# Altium project RK_MEGAPLATA.PrjPcb (part 8 of 9)

## Sheet ETHERNET_PHY_RGMII.SchDoc
size 594 x 420 mm; SheetNumber: 22; SheetTotal: 23
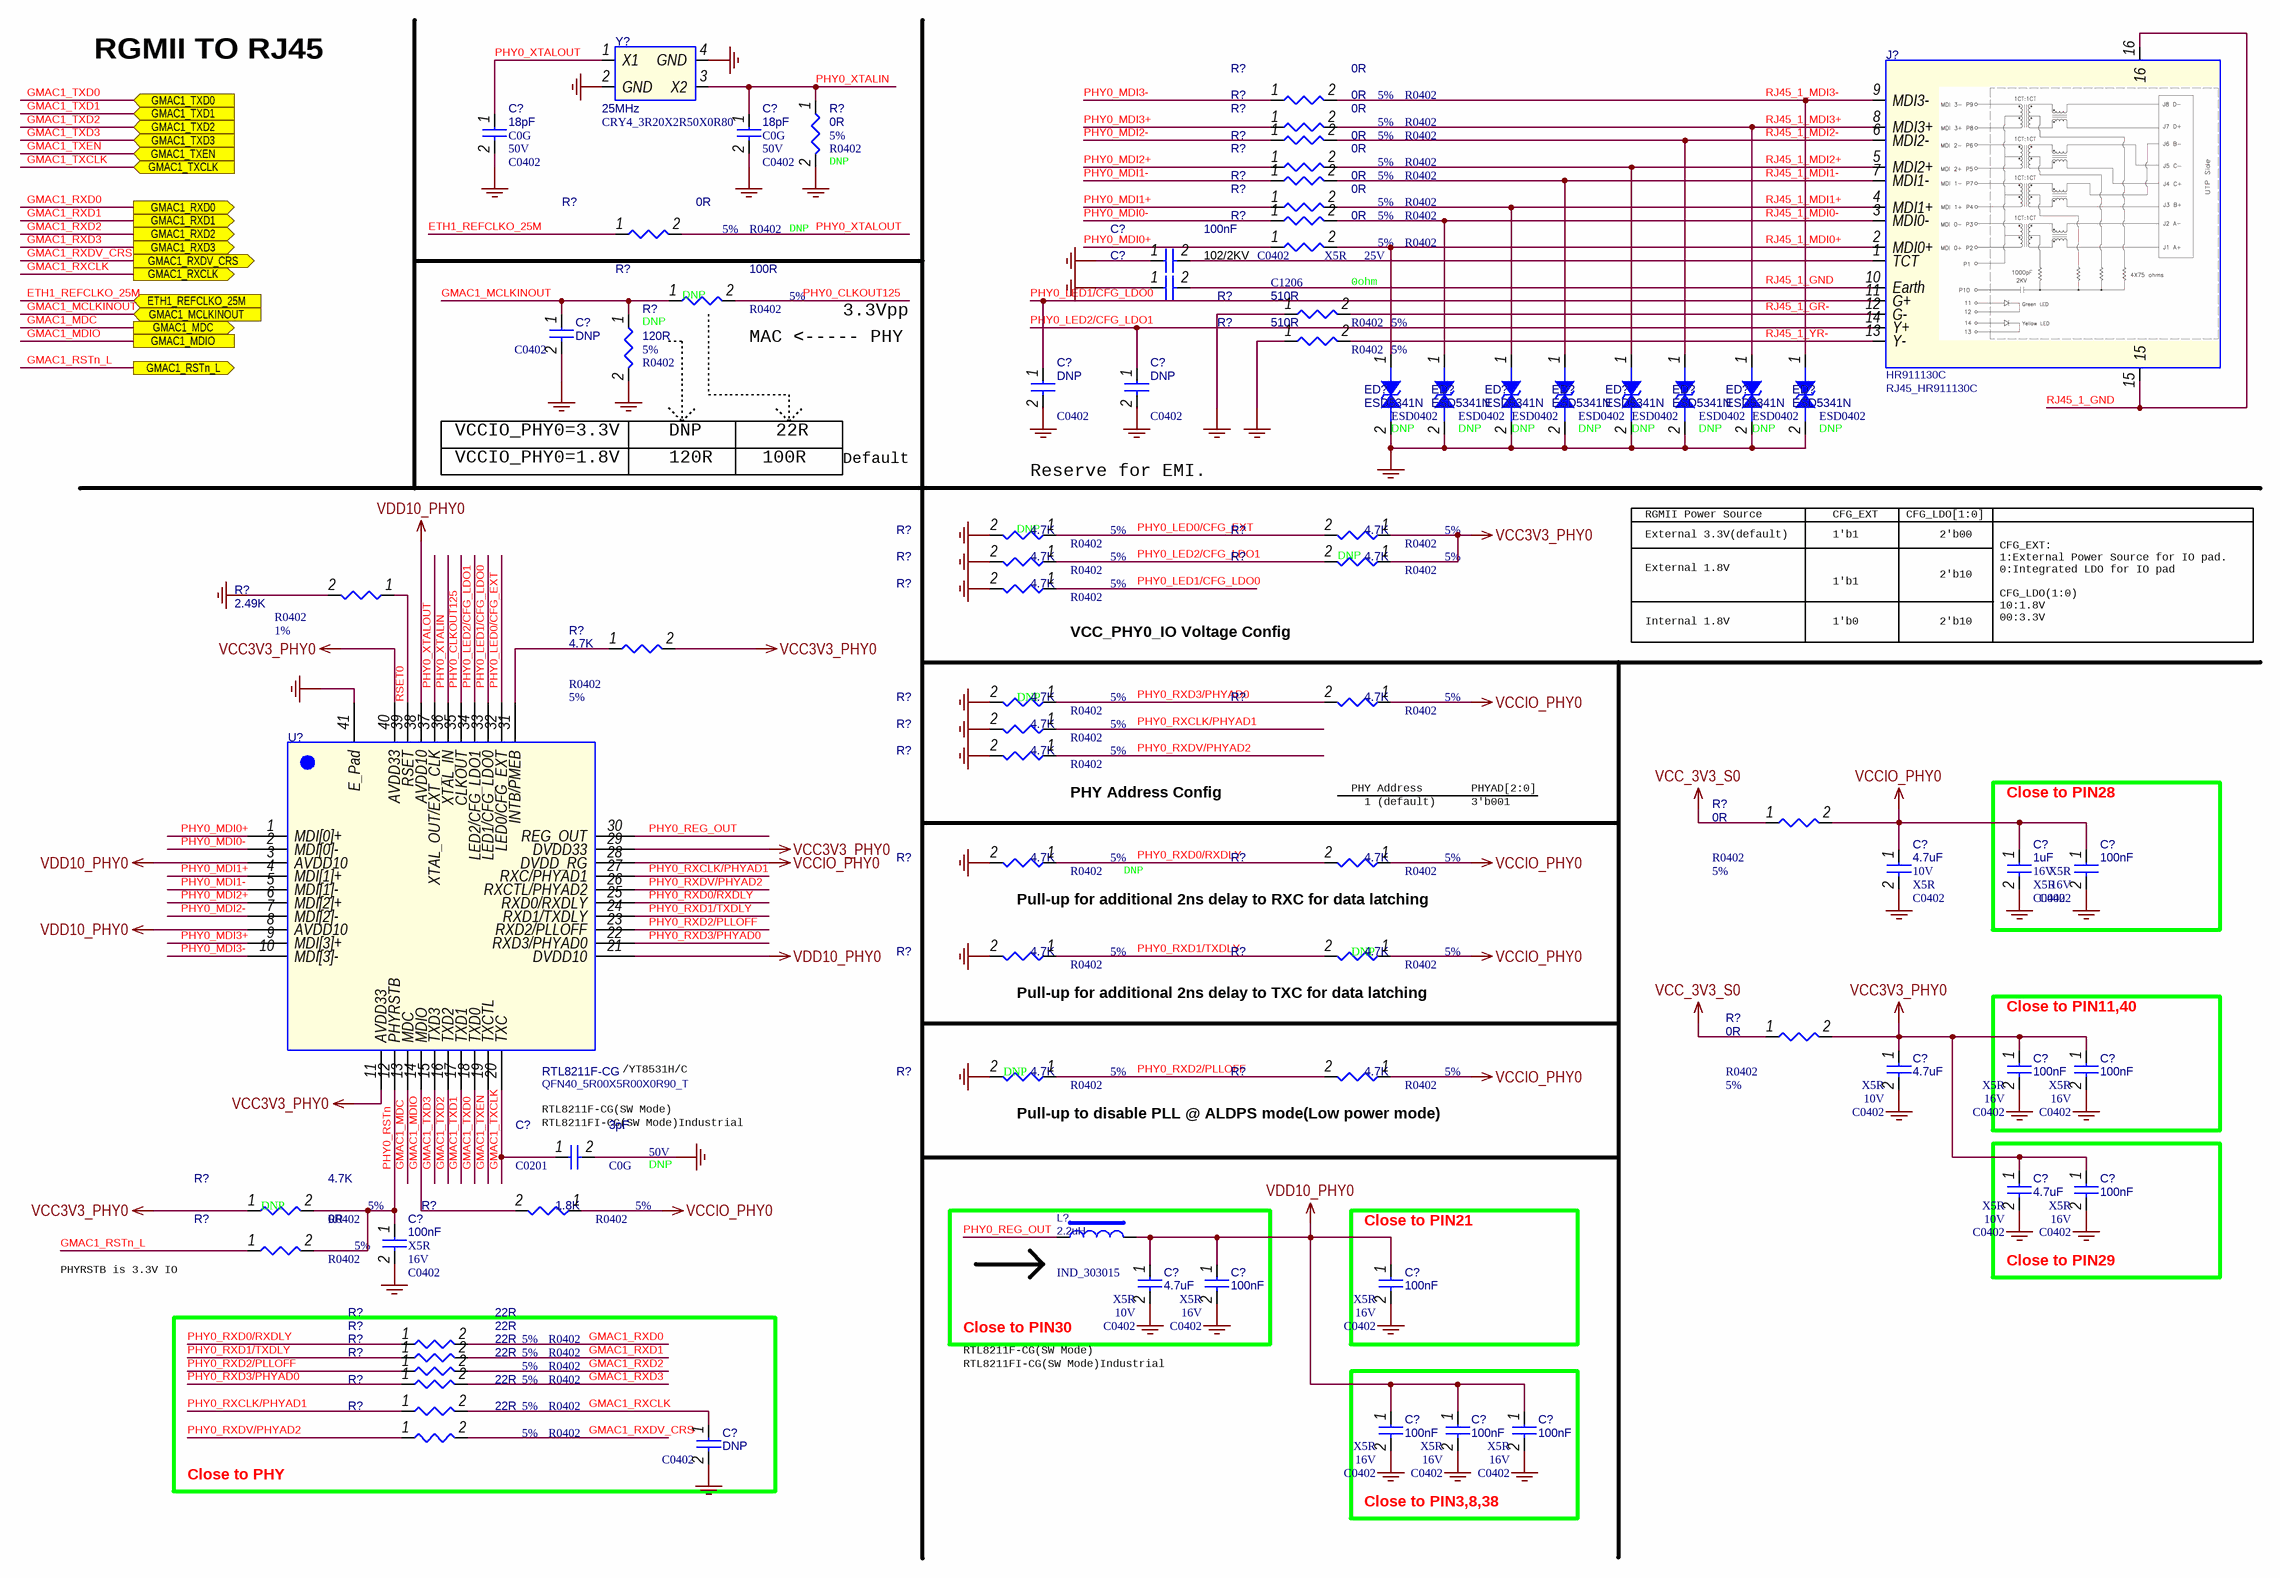
[diagram p24: ETHERNET_PHY_RGMII.SchDoc]

### Parts
(Parts that share a designator on the sheet are numbered #1, #2 ... from top to bottom, then left to right.)
C?#312  18pF  Dielectric: C0G  Voltage: 50V  [C0402]
C?#313  18pF  Dielectric: C0G  Voltage: 50V  [C0402]
C?#314  100nF  Dielectric: X5R  Voltage: 25V  [C0402]
C?#315  102/2KV  Option: 0ohm  [C1206]
C?#316  DNP  [C0402]
C?#317  DNP  [C0402]
C?#318  DNP  [C0402]
C?#319  4.7uF  Dielectric: X5R  Voltage: 10V  [C0402]
C?#320  1uF  Dielectric: X5R  Voltage: 16V  [C0402]
C?#321  100nF  Dielectric: X5R  Voltage: 16V  [C0402]
C?#322  4.7uF  Dielectric: X5R  Voltage: 10V  [C0402]
C?#323  100nF  Dielectric: X5R  Voltage: 16V  [C0402]
C?#324  100nF  Dielectric: X5R  Voltage: 16V  [C0402]
C?#325  3pF  Dielectric: C0G  Voltage: 50V  OPTION: DNP  [C0201]
C?#326  4.7uF  Dielectric: X5R  Voltage: 10V  [C0402]
C?#327  100nF  Dielectric: X5R  Voltage: 16V  [C0402]
C?#328  100nF  Dielectric: X5R  Voltage: 16V  [C0402]
C?#329  4.7uF  Dielectric: X5R  Voltage: 10V  [C0402]
C?#330  100nF  Dielectric: X5R  Voltage: 16V  [C0402]
C?#331  100nF  Dielectric: X5R  Voltage: 16V  [C0402]
C?#332  100nF  Dielectric: X5R  Voltage: 16V  [C0402]
C?#333  100nF  Dielectric: X5R  Voltage: 16V  [C0402]
C?#334  100nF  Dielectric: X5R  Voltage: 16V  [C0402]
C?#335  DNP  [C0402]
ED?#13  ESD5341N  OPTION: DNP  [ESD0402]
ED?#14  ESD5341N  OPTION: DNP  [ESD0402]
ED?#15  ESD5341N  OPTION: DNP  [ESD0402]
ED?#16  ESD5341N  OPTION: DNP  [ESD0402]
ED?#17  ESD5341N  OPTION: DNP  [ESD0402]
ED?#18  ESD5341N  OPTION: DNP  [ESD0402]
ED?#19  ESD5341N  OPTION: DNP  [ESD0402]
ED?#20  ESD5341N  OPTION: DNP  [ESD0402]
J?#8  HR911130C  PCB Footprint: RJ45_HR911130C  [RJ45_PULSE]
L?#16  2.2uH  [IND_303015]
R?#166  0R  Tolerance: 5%  OPTION: DNP  [R0402]
R?#167  0R  Tolerance: 5%  [R0402]
R?#168  0R  Tolerance: 5%  [R0402]
R?#169  0R  Tolerance: 5%  [R0402]
R?#170  0R  Tolerance: 5%  [R0402]
R?#171  0R  Tolerance: 5%  [R0402]
R?#172  0R  Tolerance: 5%  [R0402]
R?#173  0R  Tolerance: 5%  [R0402]
R?#174  0R  Tolerance: 5%  OPTION: DNP  [R0402]
R?#175  0R  Tolerance: 5%  [R0402]
R?#176  100R  Tolerance: 5%  OPTION: DNP  [R0402]
R?#177  120R  Tolerance: 5%  OPTION: DNP  [R0402]
R?#178  510R  Tolerance: 5%  [R0402]
R?#179  510R  Tolerance: 5%  [R0402]
R?#180  4.7K  Tolerance: 5%  option: DNP  [R0402]
R?#181  4.7K  Tolerance: 5%  [R0402]
R?#182  4.7K  Tolerance: 5%  [R0402]
R?#183  4.7K  Tolerance: 5%  OPTION: DNP  [R0402]
R?#184  4.7K  Tolerance: 5%  [R0402]
R?#185  2.49K  Tolerance: 1%  [R0402]
R?#186  4.7K  Tolerance: 5%  [R0402]
R?#187  4.7K  Tolerance: 5%  option: DNP  [R0402]
R?#188  4.7K  Tolerance: 5%  [R0402]
R?#189  4.7K  Tolerance: 5%  [R0402]
R?#190  4.7K  Tolerance: 5%  [R0402]
R?#191  0R  Tolerance: 5%  [R0402]
R?#192  4.7K  Tolerance: 5%  OPTION: DNP  [R0402]
R?#193  4.7K  Tolerance: 5%  [R0402]
R?#194  4.7K  Tolerance: 5%  [R0402]
R?#195  4.7K  Tolerance: 5%  option: DNP  [R0402]
R?#196  0R  Tolerance: 5%  [R0402]
R?#197  4.7K  Tolerance: 5%  option: DNP  [R0402]
R?#198  4.7K  Tolerance: 5%  [R0402]
R?#199  1.8K  Tolerance: 5%  [R0402]
R?#200  4.7K  Tolerance: 5%  Option: DNP  [R0402]
R?#201  0R  Tolerance: 5%  [R0402]
R?#202  22R  Tolerance: 5%  [R0402]
R?#203  22R  Tolerance: 5%  [R0402]
R?#204  22R  Tolerance: 5%  [R0402]
R?#205  22R  Tolerance: 5%  [R0402]
R?#206  22R  Tolerance: 5%  [R0402]
R?#207  22R  Tolerance: 5%  [R0402]
U?#41  RTL8211F-CG  PCB Footprint: QFN40_5R00X5R00X0R90_T  [QFN40_5R00X5R00X0R80_T]
Y?#2  25MHz  PCB Footprint: CRY4_3R20X2R50X0R80  [CRY-3225]

### Blocks framed on the sheet
Close to PIN28: C?#320 C?#321
Close to PIN11,40: C?#323 C?#324
Close to PIN29: C?#326 C?#327
Close to PIN30: C?#329 C?#330 L?#16
Close to PIN21: C?#331
Close to PHY: C?#335 R?#202-R?#207
Close to PIN3,8,38: C?#332-C?#334

### Ports
ETH1_REFCLKO_25M (in, see RK3588_GPIO_MAYBE_IMPORTANT_PINS[2A]), GMAC1_MCLKINOUT (in, see RK3588_GPIO_MAYBE_IMPORTANT_PINS[2B]), GMAC1_MDC (out, see RK3588_GPIO_MAYBE_IMPORTANT_PINS[2B]), GMAC1_MDIO (see RK3588_GPIO_MAYBE_IMPORTANT_PINS[2B]), GMAC1_RSTn_L (out, see RK3588_GPIO_MAYBE_IMPORTANT_PINS[2B]), GMAC1_RXCLK (out, see RK3588_GPIO_MAYBE_IMPORTANT_PINS[2A]), GMAC1_RXD0 (out, see RK3588_GPIO_MAYBE_IMPORTANT_PINS[2A]), GMAC1_RXD1 (out, see RK3588_GPIO_MAYBE_IMPORTANT_PINS[2A]), GMAC1_RXD2 (out, see RK3588_GPIO_MAYBE_IMPORTANT_PINS[2A]), GMAC1_RXD3 (out, see RK3588_GPIO_MAYBE_IMPORTANT_PINS[2A]), GMAC1_RXDV_CRS (out, see RK3588_GPIO_MAYBE_IMPORTANT_PINS[2A]), GMAC1_TXCLK (in, see RK3588_GPIO_MAYBE_IMPORTANT_PINS[2A]), GMAC1_TXD0 (in, see RK3588_GPIO_MAYBE_IMPORTANT_PINS[2A]), GMAC1_TXD1 (in, see RK3588_GPIO_MAYBE_IMPORTANT_PINS[2B]), GMAC1_TXD2 (in, see RK3588_GPIO_MAYBE_IMPORTANT_PINS[2A]), GMAC1_TXD3 (in, see RK3588_GPIO_MAYBE_IMPORTANT_PINS[2A]), GMAC1_TXEN (in, see RK3588_GPIO_MAYBE_IMPORTANT_PINS[2B])

### Nets
GND: C?#312.2 C?#313.2 C?#314.1 C?#315.1 C?#316.2 C?#317.2 C?#318.2 C?#319.2 C?#320.2 C?#321.2 C?#322.2 C?#323.2 C?#324.2 C?#325.2 C?#326.2 C?#327.2 C?#328.2 C?#329.2 C?#330.2 C?#331.2 C?#332.2 C?#333.2 C?#334.2 C?#335.2 ED?#13.2 ED?#14.2 ED?#15.2 ED?#16.2 ED?#17.2 ED?#18.2 ED?#19.2 ED?#20.2 R?#166.2 R?#177.2 R?#178.1 R?#179.1 R?#180.2 R?#182.2 R?#184.2 R?#185.2 R?#187.2 R?#189.2 R?#190.2 R?#192.2 R?#194.2 R?#197.2 U?#41.41(E_Pad) Y?#2.2(GND) Y?#2.4(GND)
VCC3V3_PHY0: C?#322.1 C?#323.1 C?#324.1 C?#326.1 C?#327.1 R?#181.1 R?#183.1 R?#186.2 R?#196.2 R?#200.1 U?#41.11(AVDD33) U?#41.29(DVDD33) U?#41.40(AVDD33)
VCC_3V3_S0: R?#191.1 R?#196.1
VCCIO_PHY0: C?#319.1 C?#320.1 C?#321.1 R?#188.1 R?#191.2 R?#193.1 R?#195.1 R?#198.1 R?#199.1 U?#41.28(DVDD_RG)
VDD10_PHY0: C?#329.1 C?#330.1 C?#331.1 C?#332.1 C?#333.1 C?#334.1 L?#16.2 U?#41.3(AVDD10) U?#41.8(AVDD10) U?#41.21(DVDD10) U?#41.38(AVDD10)
ETH1_REFCLKO_25M: R?#174.1 ; port ETH1_REFCLKO_25M
GMAC1_MCLKINOUT: C?#316.1 R?#176.1 R?#177.1 ; port GMAC1_MCLKINOUT
GMAC1_MDC: U?#41.13(MDC) ; port GMAC1_MDC
GMAC1_MDIO: R?#199.2 U?#41.14(MDIO) ; port GMAC1_MDIO
GMAC1_RSTn_L: R?#201.1 ; port GMAC1_RSTn_L
GMAC1_RXCLK: C?#335.1 R?#206.2 ; port GMAC1_RXCLK
GMAC1_RXD0: R?#202.2 ; port GMAC1_RXD0
GMAC1_RXD1: R?#203.2 ; port GMAC1_RXD1
GMAC1_RXD2: R?#204.2 ; port GMAC1_RXD2
GMAC1_RXD3: R?#205.2 ; port GMAC1_RXD3
GMAC1_RXDV_CRS: R?#207.2 ; port GMAC1_RXDV_CRS
GMAC1_TXCLK: C?#325.1 U?#41.20(TXC) ; port GMAC1_TXCLK
GMAC1_TXD0: U?#41.18(TXD0) ; port GMAC1_TXD0
GMAC1_TXD1: U?#41.17(TXD1) ; port GMAC1_TXD1
GMAC1_TXD2: U?#41.16(TXD2) ; port GMAC1_TXD2
GMAC1_TXD3: U?#41.15(TXD3) ; port GMAC1_TXD3
GMAC1_TXEN: U?#41.19(TXCTL) ; port GMAC1_TXEN
PHY0_CLKOUT125: R?#176.2 U?#41.35(CLKOUT)
PHY0_LED0/CFG_EXT: R?#180.1 R?#181.2 U?#41.32(LED0/CFG_EXT)
PHY0_LED1/CFG_LDO0: C?#317.1 J?#8.11(G+) R?#184.1 U?#41.33(LED1/CFG_LDO0)
PHY0_LED2/CFG_LDO1: C?#318.1 J?#8.14(Y+) R?#182.1 R?#183.2 U?#41.34(LED2/CFG_LDO1)
PHY0_MDI0+: R?#175.1 U?#41.1(MDI[0]+)
PHY0_MDI0-: R?#173.1 U?#41.2(MDI[0]-)
PHY0_MDI1+: R?#172.1 U?#41.4(MDI[1]+)
PHY0_MDI1-: R?#171.1 U?#41.5(MDI[1]-)
PHY0_MDI2+: R?#170.1 U?#41.6(MDI[2]+)
PHY0_MDI2-: R?#169.1 U?#41.7(MDI[2]-)
PHY0_MDI3+: R?#168.1 U?#41.9(MDI[3]+)
PHY0_MDI3-: R?#167.1 U?#41.10(MDI[3]-)
PHY0_REG_OUT: L?#16.1 U?#41.30(REG_OUT)
PHY0_RSTn: C?#328.1 R?#200.2 R?#201.2 U?#41.12(PHYRSTB)
PHY0_RXCLK/PHYAD1: R?#189.1 R?#206.1 U?#41.27(RXC/PHYAD1)
PHY0_RXD0/RXDLY: R?#192.1 R?#193.2 R?#202.1 U?#41.25(RXD0/RXDLY)
PHY0_RXD1/TXDLY: R?#194.1 R?#195.2 R?#203.1 U?#41.24(RXD1/TXDLY)
PHY0_RXD2/PLLOFF: R?#197.1 R?#198.2 R?#204.1 U?#41.23(RXD2/PLLOFF)
PHY0_RXD3/PHYAD0: R?#187.1 R?#188.2 R?#205.1 U?#41.22(RXD3/PHYAD0)
PHY0_RXDV/PHYAD2: R?#190.1 R?#207.1 U?#41.26(RXCTL/PHYAD2)
PHY0_XTALIN: C?#313.1 R?#166.1 U?#41.36(XTAL_IN) Y?#2.3(X2)
PHY0_XTALOUT: C?#312.1 R?#174.2 U?#41.37(XTAL_OUT/EXT_CLK) Y?#2.1(X1)
RJ45_1_GND: C?#315.2 J?#8.10(Earth) J?#8.15 J?#8.16
RJ45_1_GR-: J?#8.12(G-) R?#178.2
RJ45_1_MDI0+: ED?#13.1 J?#8.2(MDI0+) R?#175.2
RJ45_1_MDI0-: ED?#14.1 J?#8.3(MDI0-) R?#173.2
RJ45_1_MDI1+: ED?#15.1 J?#8.4(MDI1+) R?#172.2
RJ45_1_MDI1-: ED?#16.1 J?#8.7(MDI1-) R?#171.2
RJ45_1_MDI2+: ED?#17.1 J?#8.5(MDI2+) R?#170.2
RJ45_1_MDI2-: ED?#18.1 J?#8.6(MDI2-) R?#169.2
RJ45_1_MDI3+: ED?#19.1 J?#8.8(MDI3+) R?#168.2
RJ45_1_MDI3-: ED?#20.1 J?#8.9(MDI3-) R?#167.2
RJ45_1_YR-: J?#8.13(Y-) R?#179.2
RSET0: R?#185.1 U?#41.39(RSET)
NetC?#314_2: C?#314.2 J?#8.1(TCT)
NetR?#186_1: R?#186.1 U?#41.31(INTB/PMEB)

### Notes on the sheet
- RGMII TO RJ45
- (near R?#176) MAC <----- PHY
- 3.3Vpp
- VCCIO_PHY0=3.3V
- DNP
- 22R
- VCCIO_PHY0=1.8V
- 120R
- 100R
- Default
- Reserve for EMI.
- RGMII Power Source
- External 3.3V(default)
- External 1.8V
- CFG_EXT
- 1'b1
- CFG_LDO[1:0]
- 2'b00
- Internal 1.8V
- 1'b0
- 2'b10
- CFG_EXT:
  1:External Power Source for IO pad.
  0:Integrated LDO for IO pad
  CFG_LDO(1:0)
  10:1.8V
  00:3.3V
- (near R?#184) VCC_PHY0_IO Voltage Config
- (near R?#190) PHY Address Config
- PHY Address
- 1 (default)
- PHYAD[2:0]
- 3'b001
- (near R?#193) Pull-up for additional 2ns delay to RXC for data latching
- (near R?#194) Pull-up for additional 2ns delay to TXC for data latching
- (near U?#41) /YT8531H/C
- RTL8211F-CG(SW Mode)
- (near C?#325) RTL8211FI-CG(SW Mode)Industrial
- (near R?#198) Pull-up to disable PLL @ ALDPS mode(Low power mode)
- PHYRSTB is 3.3V IO
- RTL8211FI-CG(SW Mode)Industrial
- 420x594
- Формат А2

### Library data of the parts
C?#312 = CAP NP_Dup1: cap,18.00pF,+/-5%,50V,C0G,C0402; Part Reference: C6701; Manufacturer: TDK; RK PN: C1005C0G1H180J050BA; Priority: A; Tolerance: 5%; PCB Footprint: C0402; Value: 18pF; Part Type: C0402; Manufacturer PN: C1005C0G1H180J050BA; Created by: JJJ
C?#313 = CAP NP_Dup1: cap,18.00pF,+/-5%,50V,C0G,C0402; Part Reference: C6700; Manufacturer: TDK; RK PN: C1005C0G1H180J050BA; Priority: A; Tolerance: 5%; PCB Footprint: C0402; Value: 18pF; Part Type: C0402; Manufacturer PN: C1005C0G1H180J050BA; Created by: JJJ
C?#314 = CAP NP_Dup1: cap,100.00nF,+/-10%,25V,X5R,C0402; Part Reference: C6702; Manufacturer PN: C1005X5R1E104K050BC; Manufacturer: TDK; Tolerance: 10%; Priority: A; PCB Footprint: C0402; Value: 100nF; Created by: JJJ; Part Type: C0402; RK PN: C1005X5R1E104K050BC
C?#315 = CAP NP_Dup1: cap,10.00uF,+/-10%,50V,X5R,C1206; Part Reference: C6703; Manufacturer PN: C3216X5R1H106K160AB; Manufacturer: TDK; C_Voltage: 6.3V; Tolerance: 10%; Priority: A; Number: 37; Dielectric: X5R; PCB Footprint: C1206; Voltage: 50V; Value: 102/2KV; Created by: JJJ; Part Type: C1206; RK PN: C3216X5R1H106K160AB
C?#316 = CAP NP_Dup1: Did Not Place.; Part Reference: C6704; Manufacturer PN: DNPC0402; C_Voltage: 6.3V; Priority: A; Number: 37; PCB Footprint: C0402; Value: DNP; Created by: JJJ; Part Type: DNP; RK PN: DNPC0402
C?#317 = CAP NP_Dup1: Did Not Place.; Part Reference: C6750; Manufacturer PN: DNPC0402; Priority: A; PCB Footprint: C0402; Value: DNP; Created by: JJJ; Part Type: DNP; RK PN: DNPC0402
C?#318 = CAP NP_Dup1: Did Not Place.; Part Reference: C6751; Manufacturer PN: DNPC0402; Priority: A; PCB Footprint: C0402; Value: DNP; Created by: JJJ; Part Type: DNP; RK PN: DNPC0402
C?#319 = CAP NP_Dup1: cap,4.70uF,+/-10%,10V,X5R,C0402; Part Reference: C6707; Manufacturer: TDK; RK PN: C1005X5R1A475K050BC; Priority: A; C_Voltage: 6.3V; Tolerance: 10%; PCB Footprint: C0402; Value: 4.7uF; Part Type: C0402; Manufacturer PN: C1005X5R1A475K050BC; Created by: JJJ
C?#320 = CAP NP_Dup1: cap,1.00uF,+/-10%,16V,X5R,C0402; Part Reference: C6708; Manufacturer: TDK; RK PN: C1005X5R1C105K050BC; Priority: A; C_Voltage: 6.3V; Tolerance: 10%; PCB Footprint: C0402; Value: 1uF; Part Type: C0402; Manufacturer PN: C1005X5R1C105K050BC; Created by: JJJ
C?#321 = CAP NP_Dup1: cap,100.00nF,+/-10%,16V,X5R,C0402; Part Reference: C6709; Manufacturer: TDK; Number: 37; RK PN: C1005X5R1C104K050BA; Priority: A; Tolerance: 10%; C_Voltage: 6.3V; PCB Footprint: C0402; Value: 100nF; Part Type: C0402; Manufacturer PN: C1005X5R1C104K050BA; Created by: JJJ
C?#322 = CAP NP_Dup1: cap,4.70uF,+/-10%,10V,X5R,C0402; Part Reference: C6710; Manufacturer: TDK; RK PN: C1005X5R1A475K050BC; Priority: A; C_Voltage: 6.3V; Tolerance: 10%; PCB Footprint: C0402; Value: 4.7uF; Part Type: C0402; Manufacturer PN: C1005X5R1A475K050BC; Created by: JJJ
C?#323 = CAP NP_Dup1: cap,100.00nF,+/-10%,16V,X5R,C0402; Part Reference: C6711; Manufacturer PN: C1005X5R1C104K050BA; Manufacturer: TDK; C_Voltage: 6.3V; Tolerance: 10%; Priority: A; Number: 37; PCB Footprint: C0402; Value: 100nF; Created by: JJJ; Part Type: C0402; RK PN: C1005X5R1C104K050BA
C?#324 = CAP NP_Dup1: cap,100.00nF,+/-10%,16V,X5R,C0402; Part Reference: C6712; Manufacturer PN: C1005X5R1C104K050BA; Manufacturer: TDK; C_Voltage: 6.3V; Tolerance: 10%; Priority: A; Number: 37; PCB Footprint: C0402; Value: 100nF; Created by: JJJ; Part Type: C0402; RK PN: C1005X5R1C104K050BA
C?#325 = CAP NP_Dup1: cap,3.00pF,+/-0.25,50V,C0G,C0201; Part Reference: C6713; Manufacturer: TDK; RK PN: C0603C0G1H030C030BA; Priority: A; Tolerance: +/-0.25pF; PCB Footprint: C0201; Value: 3pF; Part Type: C0201; Manufacturer PN: C0603C0G1H030C030BA; Created by: JJJ
C?#326 = CAP NP_Dup1: cap,4.70uF,+/-10%,10V,X5R,C0402; Part Reference: C6715; Manufacturer: TDK; RK PN: C1005X5R1A475K050BC; Priority: A; C_Voltage: 6.3V; Tolerance: 10%; PCB Footprint: C0402; Value: 4.7uF; Part Type: C0402; Manufacturer PN: C1005X5R1A475K050BC; Created by: JJJ
C?#327 = CAP NP_Dup1: cap,100.00nF,+/-10%,16V,X5R,C0402; Part Reference: C6716; Manufacturer PN: C1005X5R1C104K050BA; Manufacturer: TDK; C_Voltage: 6.3V; Tolerance: 10%; Priority: A; Number: 37; PCB Footprint: C0402; Value: 100nF; Created by: JJJ; Part Type: C0402; RK PN: C1005X5R1C104K050BA
C?#328 = CAP NP_Dup1: cap,100.00nF,+/-10%,16V,X5R,C0402; Part Reference: C6714; Manufacturer PN: C1005X5R1C104K050BA; Manufacturer: TDK; Tolerance: 10%; Priority: A; PCB Footprint: C0402; Value: 100nF; Created by: JJJ; Part Type: C0402; RK PN: C1005X5R1C104K050BA
C?#329 = CAP NP_Dup1: cap,4.70uF,+/-10%,10V,X5R,C0402; Part Reference: C6717; Manufacturer PN: C1005X5R1A475K050BC; Manufacturer: TDK; Tolerance: 10%; C_Voltage: 6.3V; Priority: A; PCB Footprint: C0402; Value: 4.7uF; Created by: JJJ; Part Type: C0402; RK PN: C1005X5R1A475K050BC
C?#330 = CAP NP_Dup1: cap,100.00nF,+/-10%,16V,X5R,C0402; Part Reference: C6718; Manufacturer PN: C1005X5R1C104K050BA; Manufacturer: TDK; C_Voltage: 6.3V; Tolerance: 10%; Priority: A; Number: 37; PCB Footprint: C0402; Value: 100nF; Created by: JJJ; Part Type: C0402; RK PN: C1005X5R1C104K050BA
C?#331 = CAP NP_Dup1: cap,100.00nF,+/-10%,16V,X5R,C0402; Part Reference: C6719; Manufacturer PN: C1005X5R1C104K050BA; Manufacturer: TDK; C_Voltage: 6.3V; Tolerance: 10%; Priority: A; Number: 37; PCB Footprint: C0402; Value: 100nF; Created by: JJJ; Part Type: C0402; RK PN: C1005X5R1C104K050BA
C?#332 = CAP NP_Dup1: cap,100.00nF,+/-10%,16V,X5R,C0402; Part Reference: C6721; Manufacturer: TDK; Number: 37; RK PN: C1005X5R1C104K050BA; Priority: A; Tolerance: 10%; C_Voltage: 6.3V; PCB Footprint: C0402; Value: 100nF; Part Type: C0402; Manufacturer PN: C1005X5R1C104K050BA; Created by: JJJ
C?#333 = CAP NP_Dup1: cap,100.00nF,+/-10%,16V,X5R,C0402; Part Reference: C6722; Manufacturer: TDK; Number: 37; RK PN: C1005X5R1C104K050BA; Priority: A; Tolerance: 10%; C_Voltage: 6.3V; PCB Footprint: C0402; Value: 100nF; Part Type: C0402; Manufacturer PN: C1005X5R1C104K050BA; Created by: JJJ
C?#334 = CAP NP_Dup1: cap,100.00nF,+/-10%,16V,X5R,C0402; Part Reference: C6723; Manufacturer: TDK; Number: 37; RK PN: C1005X5R1C104K050BA; Priority: A; Tolerance: 10%; C_Voltage: 6.3V; PCB Footprint: C0402; Value: 100nF; Part Type: C0402; Manufacturer PN: C1005X5R1C104K050BA; Created by: JJJ
C?#335 = CAP NP_Dup1: Did Not Place.; Part Reference: C6720; Manufacturer PN: DNPC0402; C_Voltage: 6.3V; Priority: A; Number: 37; PCB Footprint: C0402; Value: DNP; Created by: JJJ; Part Type: DNP; RK PN: DNPC0402
ED?#13 = DIODE BI_DIR TRIG: 1-Line, Bi-directional, Transient Voltage Suppressors.1pF.; Part Reference: ED6700; Manufacturer: WillSemi(О¤¶ы°лµјМе); Priority: A; PCB Footprint: ESD0402; Value: ESD5341N; Created by: JJJ; Manufacturer PN: ESD5341N; Part Type: ESD_TVS; RK PN: ESD5341N
ED?#14 = DIODE BI_DIR TRIG: 1-Line, Bi-directional, Transient Voltage Suppressors.1pF.; Part Reference: ED6701; Manufacturer: WillSemi(О¤¶ы°лµјМе); Priority: A; PCB Footprint: ESD0402; Value: ESD5341N; Created by: JJJ; Manufacturer PN: ESD5341N; Part Type: ESD_TVS; RK PN: ESD5341N
ED?#15 = DIODE BI_DIR TRIG: 1-Line, Bi-directional, Transient Voltage Suppressors.1pF.; Part Reference: ED6702; Manufacturer: WillSemi(О¤¶ы°лµјМе); Priority: A; PCB Footprint: ESD0402; Value: ESD5341N; RK PN: ESD5341N; Part Type: ESD_TVS; Manufacturer PN: ESD5341N; Created by: JJJ
ED?#16 = DIODE BI_DIR TRIG: 1-Line, Bi-directional, Transient Voltage Suppressors.1pF.; Part Reference: ED6703; Manufacturer: WillSemi(О¤¶ы°лµјМе); Priority: A; PCB Footprint: ESD0402; Value: ESD5341N; Created by: JJJ; Manufacturer PN: ESD5341N; Part Type: ESD_TVS; RK PN: ESD5341N
ED?#17 = DIODE BI_DIR TRIG: 1-Line, Bi-directional, Transient Voltage Suppressors.1pF.; Part Reference: ED6704; Manufacturer: WillSemi(О¤¶ы°лµјМе); Priority: A; PCB Footprint: ESD0402; Value: ESD5341N; Created by: JJJ; Manufacturer PN: ESD5341N; Part Type: ESD_TVS; RK PN: ESD5341N
ED?#18 = DIODE BI_DIR TRIG: 1-Line, Bi-directional, Transient Voltage Suppressors.1pF.; Part Reference: ED6705; Manufacturer: WillSemi(О¤¶ы°лµјМе); Priority: A; PCB Footprint: ESD0402; Value: ESD5341N; RK PN: ESD5341N; Part Type: ESD_TVS; Manufacturer PN: ESD5341N; Created by: JJJ
ED?#19 = DIODE BI_DIR TRIG: 1-Line, Bi-directional, Transient Voltage Suppressors.1pF.; Part Reference: ED6706; Manufacturer: WillSemi(О¤¶ы°лµјМе); Priority: A; PCB Footprint: ESD0402; Value: ESD5341N; RK PN: ESD5341N; Part Type: ESD_TVS; Manufacturer PN: ESD5341N; Created by: JJJ
ED?#20 = DIODE BI_DIR TRIG: 1-Line, Bi-directional, Transient Voltage Suppressors.1pF.; Part Reference: ED6707; Manufacturer: WillSemi(О¤¶ы°лµјМе); Priority: A; PCB Footprint: ESD0402; Value: ESD5341N; RK PN: ESD5341N; Part Type: ESD_TVS; Manufacturer PN: ESD5341N; Created by: JJJ
J?#8 = HR911130C_0: З§ХЧНшїЪЅУїЪЈ¬ДЪЦГ±дС№Жч; Part Reference: J6700; VAL: J00-0061; DESIG: 10/100 base TX LXT971A; BOI: RJ45; FAB: PULSE; DEV: CON_PULSE_J00-61; Priority: A; REF: J00-0061; Value: HR911130C; RK PN: HR911130C; Part Type: Ethernet Jack; Manufacturer Part Number: HR911130C; Created by: JJJ
L?#16 = INDUCTORS OF FERRITE_Dup1: Power Inductor,2.2uH,0.3,IND_303015; Part Reference: L6700; Manufacturer PN: SWPA3015S2R2NT; Manufacturer: sunlord; Isat: 1.6A; DC Resistor: 0.06ohm; Resonace frequency: 86M; Tolerance: 30%; Priority: A; PCB Footprint: IND_303015; Value: 2.2uH; Created by: YTL; Irms: 1.6A; Part Type: POWER_IND; RK PN: SWPA3015S2R2NT
R?#166 = RESISTOR_Dup2: НЁУГєсД¤µзЧи,0R,+/-5%,R0402,1/16W.; Part Reference: R6701; Manufacturer: YAGEO; RK PN: RC0402JR-070RL; Priority: A; Wattage: 1/16W; PCB Footprint: R0402; Value: 0R; Part Type: НЁУГєсД¤µзЧи; Manufacturer PN: RC0402JR-070RL; Created by: YTL
R?#167 = RESISTOR_Dup2: НЁУГєсД¤µзЧи,0R,+/-5%,R0402,1/16W.; Part Reference: R6700; Manufacturer PN: RC0402JR-070RL; Manufacturer: YAGEO; Wattage: 1/16W; Priority: A; PCB Footprint: R0402; Value: 0R; Created by: YTL; Part Type: НЁУГєсД¤µзЧи; RK PN: RC0402JR-070RL
R?#168 = RESISTOR_Dup2: НЁУГєсД¤µзЧи,0R,+/-5%,R0402,1/16W.; Part Reference: R6702; Manufacturer: YAGEO; RK PN: RC0402JR-070RL; Priority: A; Wattage: 1/16W; PCB Footprint: R0402; Value: 0R; Part Type: НЁУГєсД¤µзЧи; Manufacturer PN: RC0402JR-070RL; Created by: YTL
R?#169 = RESISTOR_Dup2: НЁУГєсД¤µзЧи,0R,+/-5%,R0402,1/16W.; Part Reference: R6703; Manufacturer PN: RC0402JR-070RL; Manufacturer: YAGEO; Wattage: 1/16W; Priority: A; PCB Footprint: R0402; Value: 0R; Created by: YTL; Part Type: НЁУГєсД¤µзЧи; RK PN: RC0402JR-070RL
R?#170 = RESISTOR_Dup2: НЁУГєсД¤µзЧи,0R,+/-5%,R0402,1/16W.; Part Reference: R6704; Manufacturer: YAGEO; RK PN: RC0402JR-070RL; Priority: A; Wattage: 1/16W; PCB Footprint: R0402; Value: 0R; Part Type: НЁУГєсД¤µзЧи; Manufacturer PN: RC0402JR-070RL; Created by: YTL
R?#171 = RESISTOR_Dup2: НЁУГєсД¤µзЧи,0R,+/-5%,R0402,1/16W.; Part Reference: R6705; Manufacturer PN: RC0402JR-070RL; Manufacturer: YAGEO; Wattage: 1/16W; Priority: A; PCB Footprint: R0402; Value: 0R; Created by: YTL; Part Type: НЁУГєсД¤µзЧи; RK PN: RC0402JR-070RL
R?#172 = RESISTOR_Dup2: НЁУГєсД¤µзЧи,0R,+/-5%,R0402,1/16W.; Part Reference: R6706; Manufacturer: YAGEO; RK PN: RC0402JR-070RL; Priority: A; Wattage: 1/16W; PCB Footprint: R0402; Value: 0R; Part Type: НЁУГєсД¤µзЧи; Manufacturer PN: RC0402JR-070RL; Created by: YTL
R?#173 = RESISTOR_Dup2: НЁУГєсД¤µзЧи,0R,+/-5%,R0402,1/16W.; Part Reference: R6707; Manufacturer PN: RC0402JR-070RL; Manufacturer: YAGEO; Wattage: 1/16W; Priority: A; PCB Footprint: R0402; Value: 0R; Created by: YTL; Part Type: НЁУГєсД¤µзЧи; RK PN: RC0402JR-070RL
R?#174 = RESISTOR_Dup2: НЁУГєсД¤µзЧи,0R,+/-5%,R0402,1/16W.; Part Reference: R6708; Manufacturer: YAGEO; RK PN: RC0402JR-070RL; Priority: A; Wattage: 1/16W; PCB Footprint: R0402; Value: 0R; Part Type: НЁУГєсД¤µзЧи; Manufacturer PN: RC0402JR-070RL; Created by: YTL
R?#175 = RESISTOR_Dup2: НЁУГєсД¤µзЧи,0R,+/-5%,R0402,1/16W.; Part Reference: R6709; Manufacturer: YAGEO; RK PN: RC0402JR-070RL; Priority: A; Wattage: 1/16W; PCB Footprint: R0402; Value: 0R; Part Type: НЁУГєсД¤µзЧи; Manufacturer PN: RC0402JR-070RL; Created by: YTL
R?#176 = RESISTOR_Dup2: НЁУГєсД¤µзЧи,100R,+/-5%,R0402,1/16W.; Part Reference: R6710; Manufacturer PN: RC0402JR-07100RL; Manufacturer: YAGEO; Wattage: 1/16W; Priority: A; PCB Footprint: R0402; Value: 100R; Created by: YTL; Part Type: НЁУГєсД¤µзЧи; RK PN: RC0402JR-07100RL
R?#177 = RESISTOR_Dup2: НЁУГєсД¤µзЧи,120R,+/-5%,R0402,1/16W.; Part Reference: R6712; Manufacturer PN: RC0402JR-07120RL; Manufacturer: YAGEO; Wattage: 1/16W; Priority: A; PCB Footprint: R0402; Value: 120R; Created by: YTL; Part Type: НЁУГєсД¤µзЧи; RK PN: RC0402JR-07120RL
R?#178 = RESISTOR_Dup2: НЁУГєсД¤µзЧи,510R,+/-5%,R0402,1/16W.; Part Reference: R6711; Manufacturer PN: RC0402JR-07510RL; Manufacturer: YAGEO; Wattage: 1/16W; Priority: A; PCB Footprint: R0402; Value: 510R; Created by: YTL; Part Type: НЁУГєсД¤µзЧи; RK PN: RC0402JR-07510RL
R?#179 = RESISTOR_Dup2: НЁУГєсД¤µзЧи,510R,+/-5%,R0402,1/16W.; Part Reference: R6713; Manufacturer: YAGEO; RK PN: RC0402JR-07510RL; Priority: A; Wattage: 1/16W; PCB Footprint: R0402; Value: 510R; Part Type: НЁУГєсД¤µзЧи; Manufacturer PN: RC0402JR-07510RL; Created by: YTL
R?#180 = RESISTOR_Dup2: НЁУГєсД¤µзЧи,4K7,+/-5%,R0402,1/16W.; Part Reference: R6714; Manufacturer PN: RC0402JR-074K7L; Manufacturer: YAGEO; Wattage: 1/16W; Priority: A; PCB Footprint: R0402; Value: 4.7K; Created by: YTL; Part Type: НЁУГєсД¤µзЧи; RK PN: RC0402JR-074K7L
R?#181 = RESISTOR_Dup2: НЁУГєсД¤µзЧи,4K7,+/-5%,R0402,1/16W.; Part Reference: R6715; Manufacturer PN: RC0402JR-074K7L; Manufacturer: YAGEO; Wattage: 1/16W; Priority: A; PCB Footprint: R0402; Value: 4.7K; Created by: YTL; Part Type: НЁУГєсД¤µзЧи; RK PN: RC0402JR-074K7L
R?#182 = RESISTOR_Dup2: НЁУГєсД¤µзЧи,4K7,+/-5%,R0402,1/16W.; Part Reference: R6716; Manufacturer: YAGEO; RK PN: RC0402JR-074K7L; Priority: A; Wattage: 1/16W; PCB Footprint: R0402; Value: 4.7K; Part Type: НЁУГєсД¤µзЧи; Manufacturer PN: RC0402JR-074K7L; Created by: YTL
R?#183 = RESISTOR_Dup2: НЁУГєсД¤µзЧи,4K7,+/-5%,R0402,1/16W.; Part Reference: R6717; Manufacturer: YAGEO; RK PN: RC0402JR-074K7L; Priority: A; Wattage: 1/16W; PCB Footprint: R0402; Value: 4.7K; Part Type: НЁУГєсД¤µзЧи; Manufacturer PN: RC0402JR-074K7L; Created by: YTL
R?#184 = RESISTOR_Dup2: НЁУГєсД¤µзЧи,4K7,+/-5%,R0402,1/16W.; Part Reference: R6718; Manufacturer PN: RC0402JR-074K7L; Manufacturer: YAGEO; Wattage: 1/16W; Priority: A; PCB Footprint: R0402; Value: 4.7K; Created by: YTL; Part Type: НЁУГєсД¤µзЧи; RK PN: RC0402JR-074K7L
R?#185 = RESISTOR_Dup2: НЁУГєсД¤µзЧи,2K49,+/-1%,R0402,1/16W.; Part Reference: R6719; Manufacturer PN: RC0402FR-072K49L; Manufacturer: YAGEO; Wattage: 1/16W; Priority: A; PCB Footprint: R0402; Value: 2.49K; Created by: YTL; Part Type: НЁУГєсД¤µзЧи; RK PN: RC0402FR-072K49L
R?#186 = RESISTOR_Dup2: НЁУГєсД¤µзЧи,4K7,+/-5%,R0402,1/16W.; Part Reference: R6720; Manufacturer: YAGEO; RK PN: RC0402JR-074K7L; Priority: A; Wattage: 1/16W; PCB Footprint: R0402; Value: 4.7K; Part Type: НЁУГєсД¤µзЧи; Manufacturer PN: RC0402JR-074K7L; Created by: YTL
R?#187 = RESISTOR_Dup2: НЁУГєсД¤µзЧи,4K7,+/-5%,R0402,1/16W.; Part Reference: R6721; Manufacturer: YAGEO; RK PN: RC0402JR-074K7L; Priority: A; Wattage: 1/16W; PCB Footprint: R0402; Value: 4.7K; Part Type: НЁУГєсД¤µзЧи; Manufacturer PN: RC0402JR-074K7L; Created by: YTL
R?#188 = RESISTOR_Dup2: НЁУГєсД¤µзЧи,4K7,+/-5%,R0402,1/16W.; Part Reference: R6722; Manufacturer PN: RC0402JR-074K7L; Manufacturer: YAGEO; Wattage: 1/16W; Priority: A; PCB Footprint: R0402; Value: 4.7K; Created by: YTL; Part Type: НЁУГєсД¤µзЧи; RK PN: RC0402JR-074K7L
R?#189 = RESISTOR_Dup2: НЁУГєсД¤µзЧи,4K7,+/-5%,R0402,1/16W.; Part Reference: R6723; Manufacturer: YAGEO; RK PN: RC0402JR-074K7L; Priority: A; Wattage: 1/16W; PCB Footprint: R0402; Value: 4.7K; Part Type: НЁУГєсД¤µзЧи; Manufacturer PN: RC0402JR-074K7L; Created by: YTL
R?#190 = RESISTOR_Dup2: НЁУГєсД¤µзЧи,4K7,+/-5%,R0402,1/16W.; Part Reference: R6724; Manufacturer: YAGEO; RK PN: RC0402JR-074K7L; Priority: A; Wattage: 1/16W; PCB Footprint: R0402; Value: 4.7K; Part Type: НЁУГєсД¤µзЧи; Manufacturer PN: RC0402JR-074K7L; Created by: YTL
R?#191 = RESISTOR_Dup2: НЁУГєсД¤µзЧи,0R,+/-5%,R0402,1/16W.; Part Reference: R6727; Manufacturer PN: RC0402JR-070RL; Manufacturer: YAGEO; Wattage: 1/16W; Priority: A; PCB Footprint: R0402; Value: 0R; Created by: YTL; Part Type: НЁУГєсД¤µзЧи; RK PN: RC0402JR-070RL
R?#192 = RESISTOR_Dup2: НЁУГєсД¤µзЧи,4K7,+/-5%,R0402,1/16W.; Part Reference: R6725; Manufacturer PN: RC0402JR-074K7L; Manufacturer: YAGEO; Wattage: 1/16W; Priority: A; PCB Footprint: R0402; Value: 4.7K; Created by: YTL; Part Type: НЁУГєсД¤µзЧи; RK PN: RC0402JR-074K7L
R?#193 = RESISTOR_Dup2: НЁУГєсД¤µзЧи,4K7,+/-5%,R0402,1/16W.; Part Reference: R6726; Manufacturer: YAGEO; RK PN: RC0402JR-074K7L; Priority: A; Wattage: 1/16W; PCB Footprint: R0402; Value: 4.7K; Part Type: НЁУГєсД¤µзЧи; Manufacturer PN: RC0402JR-074K7L; Created by: YTL
R?#194 = RESISTOR_Dup2: НЁУГєсД¤µзЧи,4K7,+/-5%,R0402,1/16W.; Part Reference: R6729; Manufacturer PN: RC0402JR-074K7L; Manufacturer: YAGEO; Wattage: 1/16W; Priority: A; PCB Footprint: R0402; Value: 4.7K; Created by: YTL; Part Type: НЁУГєсД¤µзЧи; RK PN: RC0402JR-074K7L
R?#195 = RESISTOR_Dup2: НЁУГєсД¤µзЧи,4K7,+/-5%,R0402,1/16W.; Part Reference: R6728; Manufacturer: YAGEO; RK PN: RC0402JR-074K7L; Priority: A; Wattage: 1/16W; PCB Footprint: R0402; Value: 4.7K; Part Type: НЁУГєсД¤µзЧи; Manufacturer PN: RC0402JR-074K7L; Created by: YTL
R?#196 = RESISTOR_Dup2: НЁУГєсД¤µзЧи,0R,+/-5%,R0402,1/16W.; Part Reference: R6732; Manufacturer PN: RC0402JR-070RL; Manufacturer: YAGEO; Wattage: 1/16W; Priority: A; PCB Footprint: R0402; Value: 0R; Created by: YTL; Part Type: НЁУГєсД¤µзЧи; RK PN: RC0402JR-070RL
R?#197 = RESISTOR_Dup2: НЁУГєсД¤µзЧи,4K7,+/-5%,R0402,1/16W.; Part Reference: R6730; Manufacturer: YAGEO; RK PN: RC0402JR-074K7L; Priority: A; Wattage: 1/16W; PCB Footprint: R0402; Value: 4.7K; Part Type: НЁУГєсД¤µзЧи; Manufacturer PN: RC0402JR-074K7L; Created by: YTL
R?#198 = RESISTOR_Dup2: НЁУГєсД¤µзЧи,4K7,+/-5%,R0402,1/16W.; Part Reference: R6731; Manufacturer PN: RC0402JR-074K7L; Manufacturer: YAGEO; Wattage: 1/16W; Priority: A; PCB Footprint: R0402; Value: 4.7K; Created by: YTL; Part Type: НЁУГєсД¤µзЧи; RK PN: RC0402JR-074K7L
R?#199 = RESISTOR_Dup2: НЁУГєсД¤µзЧи,1K8,+/-5%,R0402,1/16W.; Part Reference: R6734; Manufacturer: YAGEO; RK PN: RC0402JR-071K8L; Priority: A; Wattage: 1/16W; PCB Footprint: R0402; Value: 1.8K; Part Type: НЁУГєсД¤µзЧи; Manufacturer PN: RC0402JR-071K8L; Created by: YTL
R?#200 = RESISTOR_Dup2: НЁУГєсД¤µзЧи,4K7,+/-5%,R0402,1/16W.; Part Reference: R6733; Manufacturer PN: RC0402JR-074K7L; Manufacturer: YAGEO; Wattage: 1/16W; Priority: A; PCB Footprint: R0402; Value: 4.7K; Created by: YTL; Part Type: НЁУГєсД¤µзЧи; RK PN: RC0402JR-074K7L
R?#201 = RESISTOR_Dup2: НЁУГєсД¤µзЧи,0R,+/-5%,R0402,1/16W.; Part Reference: R6735; Manufacturer PN: RC0402JR-070RL; Manufacturer: YAGEO; Wattage: 1/16W; Priority: A; PCB Footprint: R0402; Value: 0R; Created by: YTL; Part Type: НЁУГєсД¤µзЧи; RK PN: RC0402JR-070RL
R?#202 = RESISTOR_Dup2: НЁУГєсД¤µзЧи,22R,+/-5%,R0402,1/16W.; Part Reference: R6736; Manufacturer PN: RC0402JR-0722RL; Manufacturer: YAGEO; Wattage: 1/16W; Priority: A; PCB Footprint: R0402; Value: 22R; Created by: YTL; Part Type: НЁУГєсД¤µзЧи; RK PN: RC0402JR-0722RL
R?#203 = RESISTOR_Dup2: НЁУГєсД¤µзЧи,22R,+/-5%,R0402,1/16W.; Part Reference: R6737; Manufacturer: YAGEO; RK PN: RC0402JR-0722RL; Priority: A; Wattage: 1/16W; PCB Footprint: R0402; Value: 22R; Part Type: НЁУГєсД¤µзЧи; Manufacturer PN: RC0402JR-0722RL; Created by: YTL
R?#204 = RESISTOR_Dup2: НЁУГєсД¤µзЧи,22R,+/-5%,R0402,1/16W.; Part Reference: R6738; Manufacturer: YAGEO; RK PN: RC0402JR-0722RL; Priority: A; Wattage: 1/16W; PCB Footprint: R0402; Value: 22R; Part Type: НЁУГєсД¤µзЧи; Manufacturer PN: RC0402JR-0722RL; Created by: YTL
R?#205 = RESISTOR_Dup2: НЁУГєсД¤µзЧи,22R,+/-5%,R0402,1/16W.; Part Reference: R6739; Manufacturer: YAGEO; RK PN: RC0402JR-0722RL; Priority: A; Wattage: 1/16W; PCB Footprint: R0402; Value: 22R; Part Type: НЁУГєсД¤µзЧи; Manufacturer PN: RC0402JR-0722RL; Created by: YTL
R?#206 = RESISTOR_Dup2: НЁУГєсД¤µзЧи,22R,+/-5%,R0402,1/16W.; Part Reference: R6740; Manufacturer: YAGEO; RK PN: RC0402JR-0722RL; Priority: A; Wattage: 1/16W; PCB Footprint: R0402; Value: 22R; Part Type: НЁУГєсД¤µзЧи; Manufacturer PN: RC0402JR-0722RL; Created by: YTL
R?#207 = RESISTOR_Dup2: НЁУГєсД¤µзЧи,22R,+/-5%,R0402,1/16W.; Part Reference: R6741; Manufacturer: YAGEO; RK PN: RC0402JR-0722RL; Priority: A; Wattage: 1/16W; PCB Footprint: R0402; Value: 22R; Part Type: НЁУГєсД¤µзЧи; Manufacturer PN: RC0402JR-0722RL; Created by: YTL
U?#41 = Ethernet_RTL8211F: Integrated 10/100/1000 Gigabit Ethernet TransceiverЈ¬Supports IEEE 802.3az-2010,; Part Reference: U6700; Manufacturer: RealTek(ИркЕ); Priority: A; Value: RTL8211F-CG; RK PN: RTL8211F-CG; Part Type: Ethernet; Manufacturer PN: RTL8211F-CG; Created by: JJJ
Y?#2 = CRYSTAL_4P: ОЮФґѕ§ХсЈ¬25MЈ¬3225,ЎА10ppmЈ¬10pFЈ¬Hosonic; Part Reference: Y6700; Manufacturer PN: E3SB25.0000F10E11; Manufacturer: Hosonic(єиРЗµзЧУ); Priority: A; Value: 25MHz; Created by: JJJ; Part Type: CRYSTAL; RK PN: E3SB25.0000F10E11

## Sheet BUTTON.SchDoc
size 209 x 297 mm; SheetNumber: 23; SheetTotal: 23
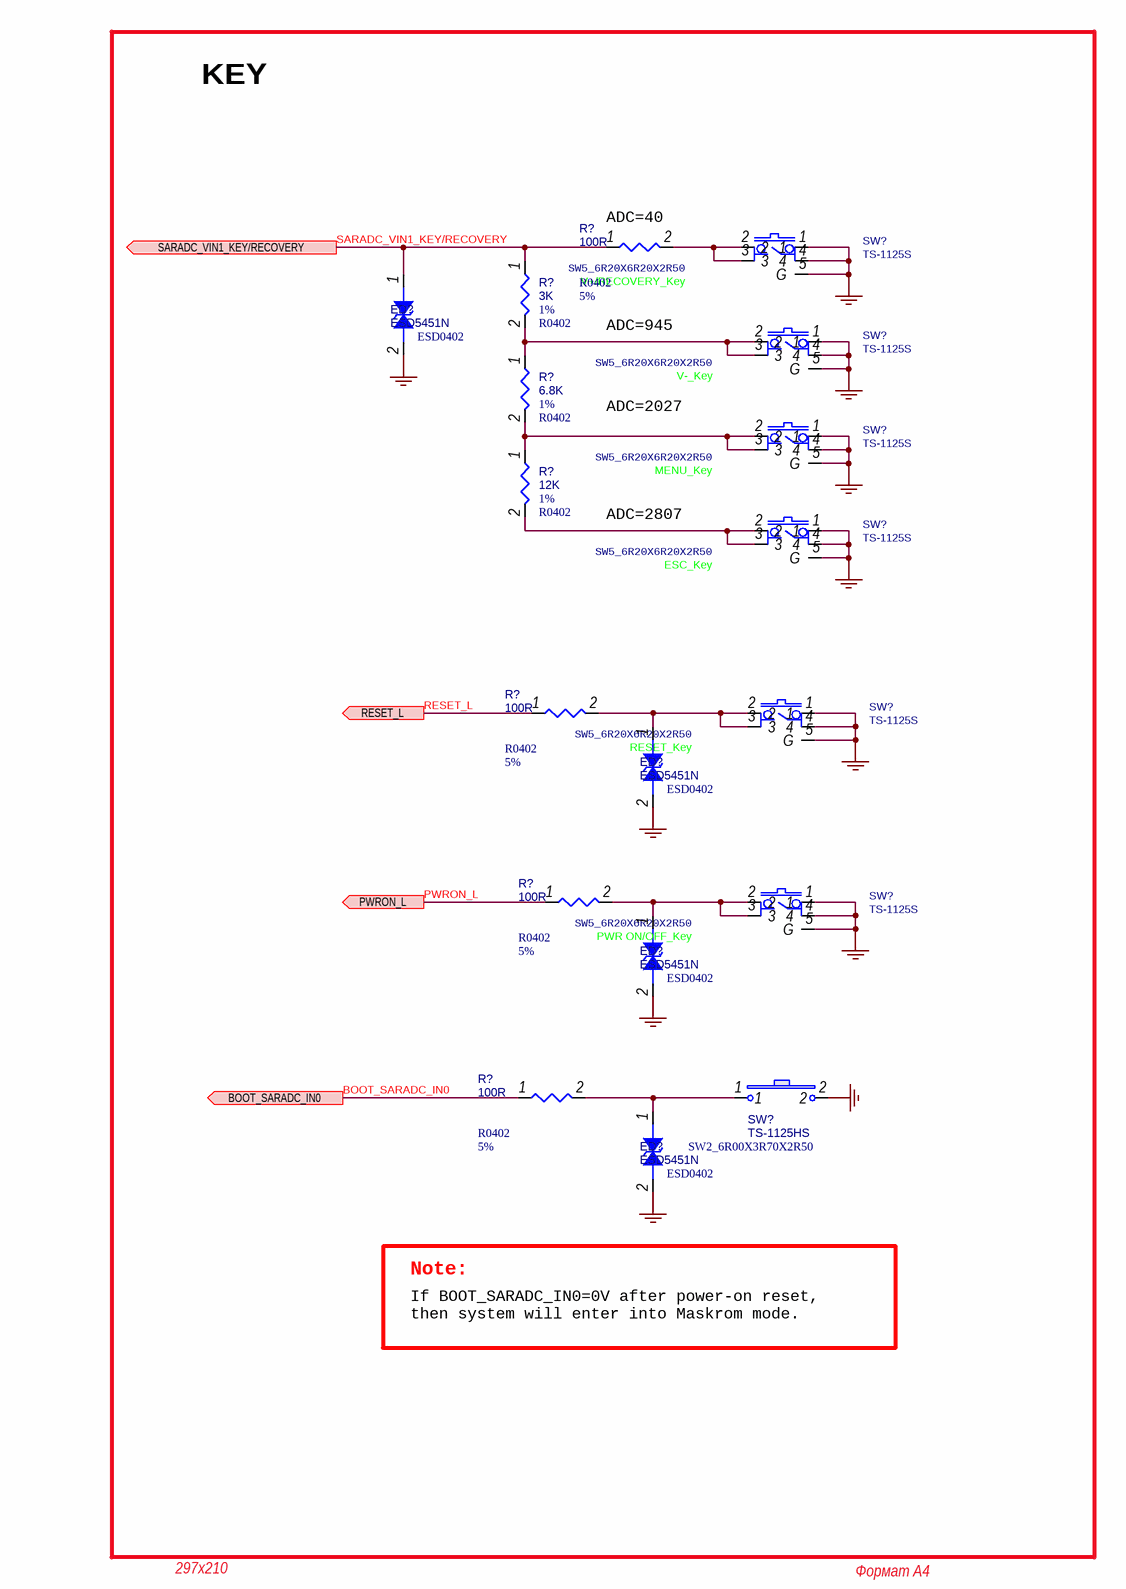
[diagram p25: BUTTON.SchDoc]

### Parts
(Parts that share a designator on the sheet are numbered #1, #2 ... from top to bottom, then left to right.)
ED?#21  ESD5451N  [ESD0402]
ED?#22  ESD5451N  [ESD0402]
ED?#23  ESD5451N  [ESD0402]
ED?#24  ESD5451N  [ESD0402]
R?#208  100R  Tolerance: 5%  [R0402]
R?#209  3K  Tolerance: 1%  [R0402]
R?#210  6.8K  Tolerance: 1%  [R0402]
R?#211  12K  Tolerance: 1%  [R0402]
R?#212  100R  Tolerance: 5%  [R0402]
R?#213  100R  Tolerance: 5%  [R0402]
R?#214  100R  Tolerance: 5%  [R0402]
SW?#1  TS-1125S  option: V+/RECOVERY_Key  [SW5_6R20X6R20X2R50]
SW?#2  TS-1125S  option: V-_Key  [SW5_6R20X6R20X2R50]
SW?#3  TS-1125S  option: MENU_Key  [SW5_6R20X6R20X2R50]
SW?#4  TS-1125S  option: ESC_Key  [SW5_6R20X6R20X2R50]
SW?#5  TS-1125S  option: RESET_Key  [SW5_6R20X6R20X2R50]
SW?#6  TS-1125S  option: PWR ON/OFF_Key  [SW5_6R20X6R20X2R50]
SW?#7  TS-1125HS  PCB Footprint: SW2_6R00X3R70X2R50  [YC-6615B]

### Ports
BOOT_SARADC_IN0 (out, see RK3588_BOOTLOADER_MAYBE_SDIO[4B]), PWRON_L (out, see POWER_RK806[1A]), RESET_L (out, see POWER_RK806[1A], RK3588_OSC_PLL[4A]), SARADC_VIN1_KEY/RECOVERY (out, see RK3588_BOOTLOADER_MAYBE_SDIO[4B])

### Nets
GND: ED?#21.2 ED?#22.2 ED?#23.2 ED?#24.2 SW?#1.1 SW?#1.4 SW?#1.5(G) SW?#2.1 SW?#2.4 SW?#2.5(G) SW?#3.1 SW?#3.4 SW?#3.5(G) SW?#4.1 SW?#4.4 SW?#4.5(G) SW?#5.1 SW?#5.4 SW?#5.5(G) SW?#6.1 SW?#6.4 SW?#6.5(G) SW?#7.2
BOOT_SARADC_IN0: R?#214.1 ; port BOOT_SARADC_IN0
PWRON_L: R?#213.1 ; port PWRON_L
RESET_L: R?#212.1 ; port RESET_L
SARADC_VIN1_KEY/RECOVERY: ED?#21.1 R?#208.1 R?#209.1 ; port SARADC_VIN1_KEY/RECOVERY
NetED?#22_1: ED?#22.1 R?#212.2 SW?#5.2 SW?#5.3
NetED?#23_1: ED?#23.1 R?#213.2 SW?#6.2 SW?#6.3
NetED?#24_1: ED?#24.1 R?#214.2 SW?#7.1
NetR?#208_2: R?#208.2 SW?#1.2 SW?#1.3
NetR?#209_2: R?#209.2 R?#210.1 SW?#2.2 SW?#2.3
NetR?#210_2: R?#210.2 R?#211.1 SW?#3.2 SW?#3.3
NetR?#211_2: R?#211.2 SW?#4.2 SW?#4.3

### Notes on the sheet
- KEY
- (near R?#208) ADC=40
- ADC=945
- ADC=2027
- ADC=2807
- Note:
- If BOOT_SARADC_IN0=0V after power-on reset,
  then system will enter into Maskrom mode.
- 297x210
- Формат А4

### Library data of the parts
ED?#21 = DIODE BI_DIR TRIG: 1-Line, Bi-directional, Transient Voltage Suppressors.17.5pF.; Part Reference: ED9200; Manufacturer: WillSemi(О¤¶ы°лµјМе); Priority: A; PCB Footprint: ESD0402; Value: ESD5451N; Created by: JJJ; Manufacturer PN: ESD5451N; Part Type: ESD_TVS; RK PN: ESD5451N
ED?#22 = DIODE BI_DIR TRIG: 1-Line, Bi-directional, Transient Voltage Suppressors.17.5pF.; Part Reference: ED9201; Manufacturer: WillSemi(О¤¶ы°лµјМе); Priority: A; PCB Footprint: ESD0402; Value: ESD5451N; RK PN: ESD5451N; Part Type: ESD_TVS; Manufacturer PN: ESD5451N; Created by: JJJ
ED?#23 = DIODE BI_DIR TRIG: 1-Line, Bi-directional, Transient Voltage Suppressors.17.5pF.; Part Reference: ED9202; Manufacturer: WillSemi(О¤¶ы°лµјМе); Priority: A; PCB Footprint: ESD0402; Value: ESD5451N; Created by: JJJ; Manufacturer PN: ESD5451N; Part Type: ESD_TVS; RK PN: ESD5451N
ED?#24 = DIODE BI_DIR TRIG: 1-Line, Bi-directional, Transient Voltage Suppressors.17.5pF.; Part Reference: ED9203; Manufacturer: WillSemi(О¤¶ы°лµјМе); Priority: A; PCB Footprint: ESD0402; Value: ESD5451N; Created by: JJJ; Manufacturer PN: ESD5451N; Part Type: ESD_TVS; RK PN: ESD5451N
R?#208 = RESISTOR_Dup2: НЁУГєсД¤µзЧи,100R,+/-5%,R0402,1/16W.; Part Reference: R9200; Manufacturer PN: RC0402JR-07100RL; Manufacturer: YAGEO; Wattage: 1/16W; Priority: A; PCB Footprint: R0402; Value: 100R; Created by: YTL; Part Type: НЁУГєсД¤µзЧи; RK PN: RC0402JR-07100RL
R?#209 = RESISTOR_Dup2: НЁУГєсД¤µзЧи,3K,+/-1%,R0402,1/16W.; Part Reference: R9202; Manufacturer PN: RC0402FR-073KL; Manufacturer: YAGEO; Wattage: 1/16W; Priority: A; PCB Footprint: R0402; Value: 3K; Created by: YTL; Part Type: НЁУГєсД¤µзЧи; RK PN: RC0402FR-073KL
R?#210 = RESISTOR_Dup2: НЁУГєсД¤µзЧи,6K8,+/-1%,R0402,1/16W.; Part Reference: R9203; Manufacturer PN: RC0402FR-076K8L; Manufacturer: YAGEO; Wattage: 1/16W; Priority: A; PCB Footprint: R0402; Value: 6.8K; Created by: YTL; Part Type: НЁУГєсД¤µзЧи; RK PN: RC0402FR-076K8L
R?#211 = RESISTOR_Dup2: НЁУГєсД¤µзЧи,12K,+/-1%,R0402,1/16W.; Part Reference: R9205; Manufacturer PN: RC0402FR-0712KL; Manufacturer: YAGEO; Wattage: 1/16W; Priority: A; PCB Footprint: R0402; Value: 12K; Created by: YTL; Part Type: НЁУГєсД¤µзЧи; RK PN: RC0402FR-0712KL
R?#212 = RESISTOR_Dup2: НЁУГєсД¤µзЧи,100R,+/-5%,R0402,1/16W.; Part Reference: R9201; Manufacturer: YAGEO; RK PN: RC0402JR-07100RL; Priority: A; Wattage: 1/16W; PCB Footprint: R0402; Value: 100R; Part Type: НЁУГєсД¤µзЧи; Manufacturer PN: RC0402JR-07100RL; Created by: YTL
R?#213 = RESISTOR_Dup2: НЁУГєсД¤µзЧи,100R,+/-5%,R0402,1/16W.; Part Reference: R9204; Manufacturer PN: RC0402JR-07100RL; Manufacturer: YAGEO; Wattage: 1/16W; Priority: A; PCB Footprint: R0402; Value: 100R; Created by: YTL; Part Type: НЁУГєсД¤µзЧи; RK PN: RC0402JR-07100RL
R?#214 = RESISTOR_Dup2: НЁУГєсД¤µзЧи,100R,+/-5%,R0402,1/16W.; Part Reference: R9206; Manufacturer: YAGEO; RK PN: RC0402JR-07100RL; Priority: A; Wattage: 1/16W; PCB Footprint: R0402; Value: 100R; Part Type: НЁУГєсД¤µзЧи; Manufacturer PN: RC0402JR-07100RL; Created by: YTL
SW?#1 = KEY_5PIN: 5ЅЕМщЖ¬Ј¬6.2MMx6.2MM°ґјь; Part Reference: SW9200; Manufacturer: Сw»ЄµзЧУ; Priority: A; Value: TS-1125S; PCB Footprint: SW5_6R20X6R20X2R50; RK PN: TS-1125S; Part Type: KEY; Manufacturer Part Number: TS-1125S; Created by: YWQ
SW?#2 = KEY_5PIN: 5ЅЕМщЖ¬Ј¬6.2MMx6.2MM°ґјь; Part Reference: SW9202; Manufacturer: Сw»ЄµзЧУ; Priority: A; Value: TS-1125S; PCB Footprint: SW5_6R20X6R20X2R50; RK PN: TS-1125S; Part Type: KEY; Manufacturer Part Number: TS-1125S; Created by: YWQ
SW?#3 = KEY_5PIN: 5ЅЕМщЖ¬Ј¬6.2MMx6.2MM°ґјь; Part Reference: SW9203; Manufacturer: Сw»ЄµзЧУ; Priority: A; Value: TS-1125S; PCB Footprint: SW5_6R20X6R20X2R50; RK PN: TS-1125S; Part Type: KEY; Manufacturer Part Number: TS-1125S; Created by: YWQ
SW?#4 = KEY_5PIN: 5ЅЕМщЖ¬Ј¬6.2MMx6.2MM°ґјь; Part Reference: SW9205; Manufacturer: Сw»ЄµзЧУ; Priority: A; Value: TS-1125S; PCB Footprint: SW5_6R20X6R20X2R50; Created by: YWQ; Manufacturer Part Number: TS-1125S; Part Type: KEY; RK PN: TS-1125S
SW?#5 = KEY_5PIN: 5ЅЕМщЖ¬Ј¬6.2MMx6.2MM°ґјь; Part Reference: SW9201; Manufacturer: Сw»ЄµзЧУ; Priority: A; Value: TS-1125S; PCB Footprint: SW5_6R20X6R20X2R50; RK PN: TS-1125S; Part Type: KEY; Manufacturer Part Number: TS-1125S; Created by: YWQ
SW?#6 = KEY_5PIN: 5ЅЕМщЖ¬Ј¬6.2MMx6.2MM°ґјь; Part Reference: SW9204; Manufacturer: Сw»ЄµзЧУ; Priority: A; Value: TS-1125S; PCB Footprint: SW5_6R20X6R20X2R50; Created by: YWQ; Manufacturer Part Number: TS-1125S; Part Type: KEY; RK PN: TS-1125S
SW?#7 = KEY_2PIN: 2ЅЕМщЖ¬Ј¬6MMx3.7MM°ґјь; Part Reference: SW9206; Manufacturer: Сw»ЄµзЧУ; Priority: A; Value: TS-1125HS; RK PN: TS-1125HS; Part Type: KEY; Manufacturer Part Number: TS-1125HS; Created by: YWQ